# EAGLE schematic controllerRev1 (EAGLE 9.6.2)
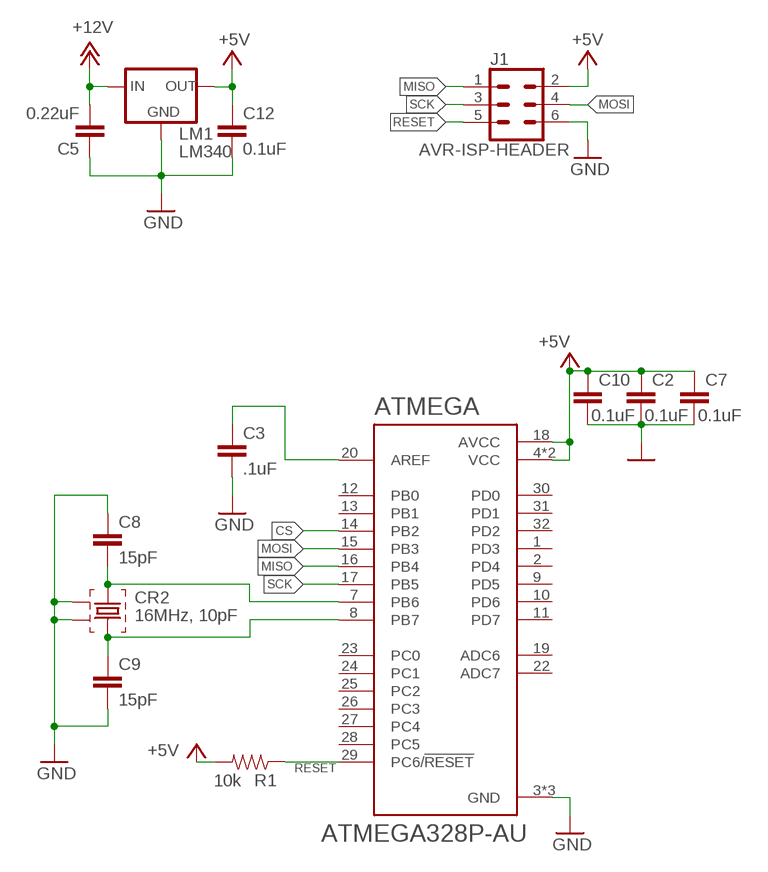
[diagram p0: schematic, sheet 1]

## Parts
ATMEGA  ATMEGA328P-AU  [QFP80P900X900X120-32N]
C2  0.1uF  CAP0603-CAP  [0603-CAP]
C3  .1uF  CAP0603-CAP  [0603-CAP]
C5  0.22uF  CAP0603-CAP  [0603-CAP]
C7  0.1uF  CAP0603-CAP  [0603-CAP]
C8  15pF  CAP0603-CAP  [0603-CAP]
C9  15pF  CAP0603-CAP  [0603-CAP]
C10  0.1uF  CAP0603-CAP  [0603-CAP]
C12  0.1uF  CAP0603-CAP  [0603-CAP]
CR2  16MHz, 10pF  ABM3B  [ABM3B]
J1  AVR-ISP-HEADER  [2X03]
LM1  LM340  [SOT223]
R1  10k  RESISTOR0603  [0603-RES]

## Nets
+5V: ATMEGA.4(VCC) ATMEGA.6(VCC) ATMEGA.18(AVCC) C2.1 C7.1 C10.1 C12.1 J1.2 LM1.3(OUT) R1.2
+12V: C5.2 LM1.1(IN)
CS: ATMEGA.14(PB2)
GND: ATMEGA.3(GND) ATMEGA.5(GND) ATMEGA.21(GND) C2.2 C3.2 C5.1 C7.2 C8.1 C9.2 C10.2 C12.2 CR2.GND CR2.GND2 J1.6 LM1.2(GND) LM1.4(GND)
MISO: ATMEGA.16(PB4) J1.1
MOSI: ATMEGA.15(PB3) J1.4
N$5: ATMEGA.7(PB6) C8.2 CR2.1
N$6: ATMEGA.8(PB7) C9.1 CR2.3
N$8: ATMEGA.20(AREF) C3.1
RESET: ATMEGA.29(PC6/!RESET) J1.5 R1.1
SCK: ATMEGA.17(PB5) J1.3
Unconnected: ATMEGA.1(PD3) ATMEGA.2(PD4) ATMEGA.9(PD5) ATMEGA.10(PD6) ATMEGA.11(PD7) ATMEGA.12(PB0) ATMEGA.13(PB1) ATMEGA.19(ADC6) ATMEGA.22(ADC7) ATMEGA.23(PC0) ATMEGA.24(PC1) ATMEGA.25(PC2) ATMEGA.26(PC3) ATMEGA.27(PC4) ATMEGA.28(PC5) ATMEGA.30(PD0) ATMEGA.31(PD1) ATMEGA.32(PD2)

## Library data of the parts
ATMEGA = HyTechDevices:ATMEGA328P-AU: ATmega Series 20 MHz 32 KB Flash 2 KB SRAM 8-Bit Microcontroller - TQFP-32; AVAILABILITY: Unavailable; DESCRIPTION: AVR AVR® ATmega Microcontroller IC 8-Bit 20MHz 32KB _16K x 16_ FLASH 32-TQFP _7x7_; MF: Microchip; MP: ATMEGA328P-AU; PACKAGE: TQFP-32 Microchip; PRICE: None
C2 C3 C5 C7-C10 C12 = HyTechDevices:CAP: Capacitor Standard 0603 ceramic capacitor, and 0.1" leaded capacitor.
CR2 = HyTechDevices:ABM3B: ABM3B ceramic SMD crystal. Datasheet <https://www.mouser.com/datasheet/2/3/abm3b-39910.pdf>
J1 = HyTechDevices:AVR-ISP-HEADER: AVR ISP 6-pin Header Reference <https://en.wikipedia.org/wiki/In-system_programming>; DIGIKEY: S2011EC-03-ND
LM1 = HyTechDevices:LM340: LM340 7.5-35V to 5V SMD regulator Mouser link <https://www.mouser.com/ProductDetail/Texas-Instruments/LM340MPX-50-NOPB?qs=sGAEpiMZZMvu8NZDyZ4K0cQiG3JqdhEW>
R1 = HyTechDevices:RESISTOR: Resistor Basic schematic elements and footprints for 0603, 1206, and PTH resistors.